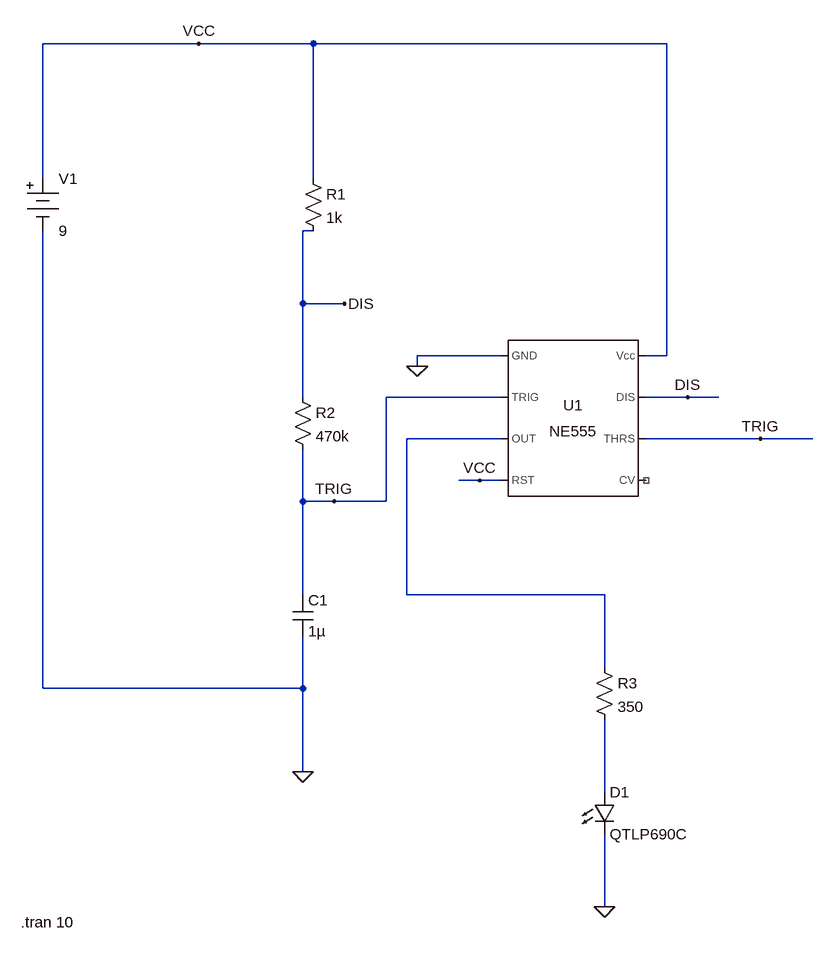
[diagram p0: schematic Blinky.asc]
Blinky.asc, the LTspice schematic file:
Version 4
SHEET 1 880 952
WIRE -384 -416 -624 -416
WIRE -208 -416 -384 -416
WIRE 336 -416 -208 -416
WIRE -624 -208 -624 -416
WIRE -208 -208 -208 -416
WIRE -208 -128 -224 -128
WIRE -224 -16 -224 -128
WIRE -160 -16 -224 -16
WIRE 80 64 -48 64
WIRE 336 64 336 -416
WIRE 336 64 304 64
WIRE -48 80 -48 64
WIRE -224 128 -224 -16
WIRE 80 128 -96 128
WIRE 368 128 304 128
WIRE 416 128 368 128
WIRE 80 192 -64 192
WIRE 480 192 304 192
WIRE 560 192 480 192
WIRE 48 256 16 256
WIRE 80 256 48 256
WIRE -224 288 -224 208
WIRE -176 288 -224 288
WIRE -96 288 -96 128
WIRE -96 288 -176 288
WIRE -224 432 -224 288
WIRE -64 432 -64 192
WIRE 240 432 -64 432
WIRE 240 544 240 432
WIRE -624 576 -624 -128
WIRE -224 576 -224 496
WIRE -224 576 -624 576
WIRE -224 704 -224 576
WIRE 240 736 240 624
WIRE 240 912 240 800
FLAG -224 704 0
FLAG 240 912 0
FLAG -48 80 0
FLAG 368 128 DIS
FLAG -160 -16 DIS
FLAG -176 288 TRIG
FLAG 480 192 TRIG
FLAG 48 256 VCC
FLAG -384 -416 VCC
SYMBOL Misc\\NE555 192 160 R0
SYMATTR InstName U1
SYMBOL res -224 -224 R0
SYMATTR InstName R1
SYMATTR Value 1k
SYMBOL res -240 112 R0
SYMATTR InstName R2
SYMATTR Value 470k
SYMBOL cap -240 432 R0
SYMATTR InstName C1
SYMATTR Value 1µ
SYMBOL res 224 528 R0
SYMATTR InstName R3
SYMATTR Value 350
SYMBOL LED 224 736 R0
SYMATTR InstName D1
SYMATTR Value QTLP690C
SYMATTR Description Diode
SYMATTR Type diode
SYMBOL Misc\\battery -624 -224 R0
WINDOW 123 0 0 Left 2
WINDOW 39 0 0 Left 2
SYMATTR InstName V1
SYMATTR Value 9
TEXT -658 936 Left 2 !.tran 10

The netlist it stands for:
* Blinky.asc
XU1 0 TRIG N001 VCC NC_01 TRIG DIS VCC NE555  ; pins GND TRIG OUT RST CV THRS DIS Vcc
R1 VCC DIS 1k
R2 DIS TRIG 470k
C1 TRIG 0 1µ
R3 N001 N002 350
D1 N002 0 QTLP690C
V1 VCC 0 9
.model D D
.lib standard.dio
.tran 10
.lib NE555.sub
.backanno
.end